# EAGLE design ne555 (EAGLE 5.10)
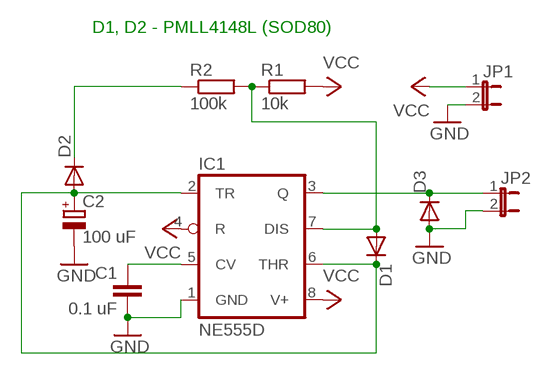
[diagram p0: schematic, sheet 1]

## Parts
C1  0.1 uF  C-EUC0805  [C0805]
C2  100 uF  CPOL-EUSMCD  [SMC_D]
D1  PMLL41SOD80C  [SOD80C]
D2  PMLL41SOD80C  [SOD80C]
D3  PMLL41SOD80C  [SOD80C]
IC1  NE555D  [SO08]
JP1  JP1E  [JP1]
JP2  JP1E  [JP1]
R1  10k  R-EU_R0805  [R0805]
R2  100k  R-EU_R0805  [R0805]

## Nets
GND: C1.2 C2.- D3.A IC1.1(GND) JP1.2 JP2.2
N$1: C2.+ D1.C D2.A IC1.2(TR) IC1.6(THR)
N$2: D2.C R2.1
N$4: D1.A IC1.7(DIS) R1.1 R2.2
N$5: D3.C IC1.3(Q) JP2.1
N$7: C1.1 IC1.5(CV)
VCC: IC1.4(R) IC1.8(V+) JP1.1 R1.2

## Notes on the sheet
- D1, D2 - PMLL4148L (SOD80)

## Library data of the parts
C1 = rcl:C-EU: CAPACITOR, European symbol
C2 = rcl:CPOL-EU: POLARIZED CAPACITOR, European symbol
D1-D3 = diode:PMLL41*: High-speed diodes Source: http://www.semiconductors.philips.com/acrobat_download/datasheets/PMLL4150_2.pdf
IC1 = linear:*555: TIMER
JP1 JP2 = jumper:JP1E: JUMPER
R1 R2 = rcl:R-EU_: RESISTOR, European symbol

## Board
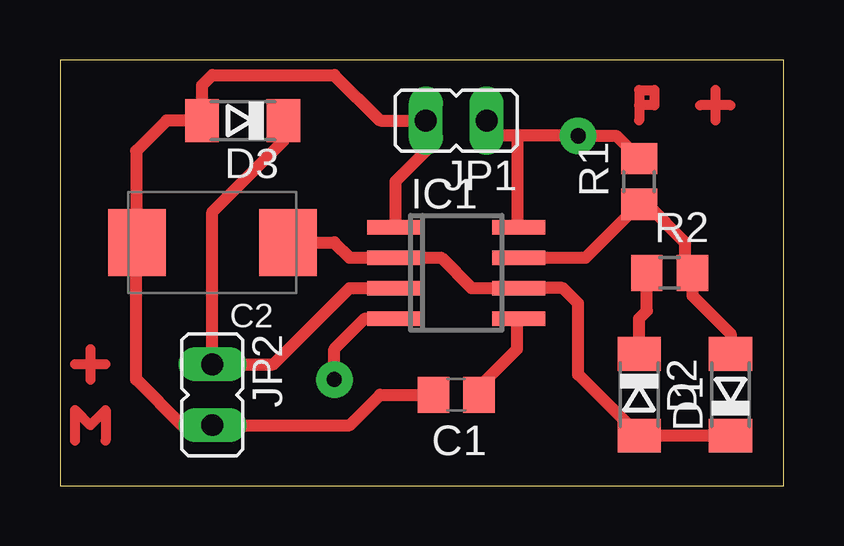
[diagram p1: board, top side]
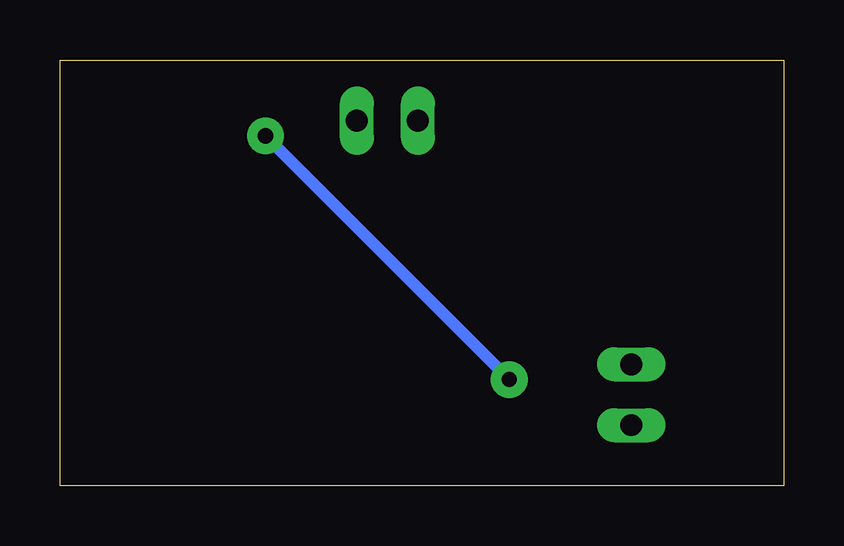
[diagram p2: board, bottom side, seen from below]

Size 30.15 x 17.77 mm. Coordinates in mm from the lower left corner, seen from the top.
Outline: 0,0 30.15,0 30.15,17.77 0,17.77 0,0
Copper layers (1*16): Top 0.035mm / dielectric 1.5mm / Bottom 0.035mm
Design rules "default": minimum track width 10mil, minimum drill 24mil, track to track 8mil, track to pad 8mil, pad to pad 8mil, via to via 8mil, smd to smd 8mil, copper to edge 40mil, drill to drill 8mil, minimum pad ring 10mil, minimum via ring 8mil, stop-mask expansion 4mil, vias tented up to drill 0mil, thermal gap 10mil

### Footprints (pad centres in the part's own frame; a part is rotated, then mirrored left to right if it is on the bottom)
C0805 = smd 1.3 x 1.5: 1 -0.95,0; 2 0.95,0
SMC_D = smd 2.4 x 2.8: + -3.15,0; - 3.15,0
SOD80C = smd 1.4 x 1.8: A 1.7,0; C -1.7,0
SO08 = smd 0.6 x 2.2: 1 -1.905,-2.6; 2 -0.635,-2.6; 3 0.635,-2.6; 4 1.905,-2.6; 5 1.905,2.6; 6 0.635,2.6; 7 -0.635,2.6; 8 -1.905,2.6
JP1 = drill 0.914 long: 1 0,-1.27; 2 0,1.27
R0805 = smd 1.3 x 1.5: 1 -0.95,0; 2 0.95,0

### Placement (x,y rotation side)
C1  16.51,3.81 180 top
C2  6.35,10.16 180 top
D1  27.94,3.81 90 top
D2  24.13,3.81 270 top
D3  7.62,15.24 180 top
IC1  16.51,8.89 270 top
JP1  16.51,15.24 90 top
JP2  6.35,3.81 180 top
R1  24.13,12.7 90 top
R2  25.4,8.89 0 top

### Tracks (layer width: path | path; a pad name or v marks a point on that pad's centre or on a via)
GND
  Top 0.508: C1.2 13.34,3.81 12.06,2.54 JP2.2 5.08,2.54 3.17,4.45 3.17,10.13 C2.- 3.17,10.19 3.17,13.97 4.45,15.24 D3.A 5.92,16.71 6.35,17.14 11.43,17.14 13.34,15.24 JP1.2 15.24,13.97 13.97,12.7 13.97,10.86 IC1.1
N$1
  Top 0.508: D1.C D2.A 21.59,4.65 21.59,7.62 20.95,8.26 IC1.6 17.14,8.26 15.88,9.53 IC1.2 12.06,9.53 11.43,10.16 C2.+
N$2
  Top 0.508: R2.1 24.45,7.3 24.13,6.99 D2.C
N$3
  Top 0.406: 1.27,5.71 1.27,4.45
N$4
  Top 0.508: IC1.7 21.91,9.53 R1.1 24.45,11.75 26.04,10.16 26.04,9.21 R2.2 26.35,7.94 27.94,6.35 D1.A
N$5
  Top 0.508: IC1.3 12.06,8.26 8.89,5.08 JP2.1 6.35,11.43 9.32,14.4 D3.C
N$6
  Top 0.406: 1.91,5.08 0.64,5.08
N$7
  Top 0.508: C1.1 17.46,4.12 19.05,5.71 19.05,6.92 IC1.5
N$8
  Top 0.406: 27.3,16.51 27.3,15.24
N$9
  Top 0.406: 27.94,15.88 26.67,15.88
N$10
  Top 0.406: 0.64,1.91 0.64,3.17 1.27,2.54 1.91,3.17 1.91,1.91
N$11
  Top 0.406: 24.13,15.88 24.13,16.51 24.77,16.51 24.77,15.88 24.13,15.88 | 24.13,15.88 24.13,15.24
VCC  (via drill 0.64 pad 1.52)
  Top 0.508: JP1.1 17.78,14.61 19.05,14.61 | IC1.8 19.05,10.86 19.05,14.61 | IC1.4 12.7,6.99 11.43,5.71 v11.43,4.45 | 19.05,14.61 v21.59,14.61 23.18,14.61 R1.2
  Bottom 0.508: v11.43,4.45 v21.59,14.61